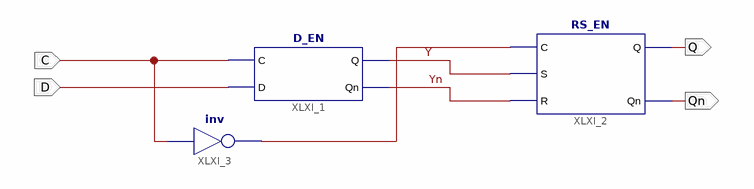
[diagram p0: schematic sheet 1]
// Xilinx ISE schematic D_Trig.sch (kintex7) as structural Verilog: 3 symbols, 4 ports
module D_Trig (
  input  C,
  input  D,
  output Q,
  output Qn
);

  wire XLXN_10, Y, Yn;

  D_EN XLXI_1 (.C(C), .D(D), .Q(Y), .Qn(Yn));
  RS_EN XLXI_2 (.C(XLXN_10), .S(Y), .R(Yn), .Q(Q), .Qn(Qn));
  not XLXI_3 (XLXN_10, C);
endmodule
